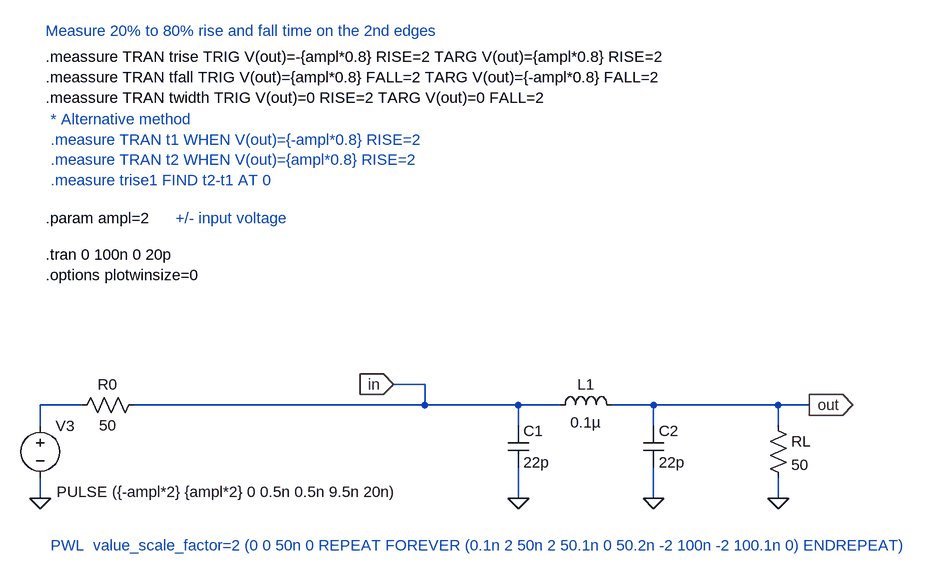
[diagram p0: schematic basic_measure2.asc]
basic_measure2.asc, the LTspice schematic file:
Version 4
SHEET 1 880 680
WIRE -800 192 -800 160
WIRE -800 304 -800 272
WIRE -736 160 -800 160
WIRE -208 128 -256 128
WIRE -208 160 -656 160
WIRE -208 160 -208 128
WIRE -64 160 -208 160
WIRE -64 192 -64 160
WIRE -64 304 -64 256
WIRE 0 160 -64 160
WIRE 144 160 80 160
WIRE 144 192 144 160
WIRE 144 304 144 256
WIRE 336 160 144 160
WIRE 336 192 336 160
WIRE 336 304 336 272
WIRE 384 160 336 160
FLAG -800 304 0
FLAG 336 304 0
FLAG 384 160 out
IOPIN 384 160 Out
FLAG -256 128 in
IOPIN -256 128 In
FLAG -64 304 0
FLAG 144 304 0
SYMBOL res -752 176 R270
WINDOW 0 32 56 VTop 0
WINDOW 3 0 56 VBottom 0
SYMATTR InstName R0
SYMATTR Value 50
SYMBOL voltage -800 176 R0
WINDOW 3 25 118 Left 0
WINDOW 123 0 0 Left 0
WINDOW 39 0 0 Left 0
SYMATTR Value PULSE ({-ampl*2} {ampl*2} 0 0.5n 0.5n 9.5n 20n)
SYMATTR InstName V3
SYMBOL res 320 176 R0
SYMATTR InstName RL
SYMATTR Value 50
SYMBOL cap -80 192 R0
SYMATTR InstName C1
SYMATTR Value 22p
SYMBOL ind -16 176 R270
WINDOW 0 32 56 VTop 0
WINDOW 3 5 56 VBottom 0
SYMATTR InstName L1
SYMATTR Value 0.1µ
SYMBOL cap 128 192 R0
SYMATTR InstName C2
SYMATTR Value 22p
TEXT -792 -72 Left 0 !.tran 0 100n 0 20p
TEXT -792 -40 Left 0 !.options plotwinsize=0
TEXT -784 376 Left 0 ;PWL  value_scale_factor=2 (0 0 50n 0 REPEAT FOREVER (0.1n 2 50n 2 50.1n 0 50.2n -2 100n -2 100.1n 0) ENDREPEAT)
TEXT -792 -128 Left 0 !.param ampl=2
TEXT -592 -128 Left 0 ;+/- input voltage
TEXT -792 -376 Left 0 !.meassure TRAN trise TRIG V(out)=-{ampl*0.8} RISE=2 TARG V(out)={ampl*0.8} RISE=2\n.meassure TRAN tfall TRIG V(out)={ampl*0.8} FALL=2 TARG V(out)={-ampl*0.8} FALL=2\n.meassure TRAN twidth TRIG V(out)=0 RISE=2 TARG V(out)=0 FALL=2
TEXT -792 -416 Left 0 ;Measure 20% to 80% rise and fall time on the 2nd edges
TEXT -784 -280 Left 0 ;* Alternative method\n.measure TRAN t1 WHEN V(out)={-ampl*0.8} RISE=2\n.measure TRAN t2 WHEN V(out)={ampl*0.8} RISE=2\n.measure trise1 FIND t2-t1 AT 0

The netlist it stands for:
* basic_measure2.asc
R0 N001 in 50
V3 N001 0 PULSE ({-ampl*2} {ampl*2} 0 0.5n 0.5n 9.5n 20n)
RL out 0 50
C1 in 0 22p
L1 in out 0.1µ
C2 out 0 22p
.tran 0 100n 0 20p
.options plotwinsize=0
* PWL  value_scale_factor=2 (0 0 50n 0 REPEAT FOREVER (0.1n 2 50n 2 50.1n 0 50.2n -2 100n -2 100.1n 0) ENDREPEAT)
.param ampl=2
* +/- input voltage
.meassure TRAN trise TRIG V(out)=-{ampl*0.8} RISE=2 TARG V(out)={ampl*0.8} RISE=2
.meassure TRAN tfall TRIG V(out)={ampl*0.8} FALL=2 TARG V(out)={-ampl*0.8} FALL=2
.meassure TRAN twidth TRIG V(out)=0 RISE=2 TARG V(out)=0 FALL=2
* Measure 20% to 80% rise and fall time on the 2nd edges
* * Alternative method
* .measure TRAN t1 WHEN V(out)={-ampl*0.8} RISE=2
* .measure TRAN t2 WHEN V(out)={ampl*0.8} RISE=2
* .measure trise1 FIND t2-t1 AT 0
.backanno
.end